# Altium project HotWaterEquipments.PRJPCB
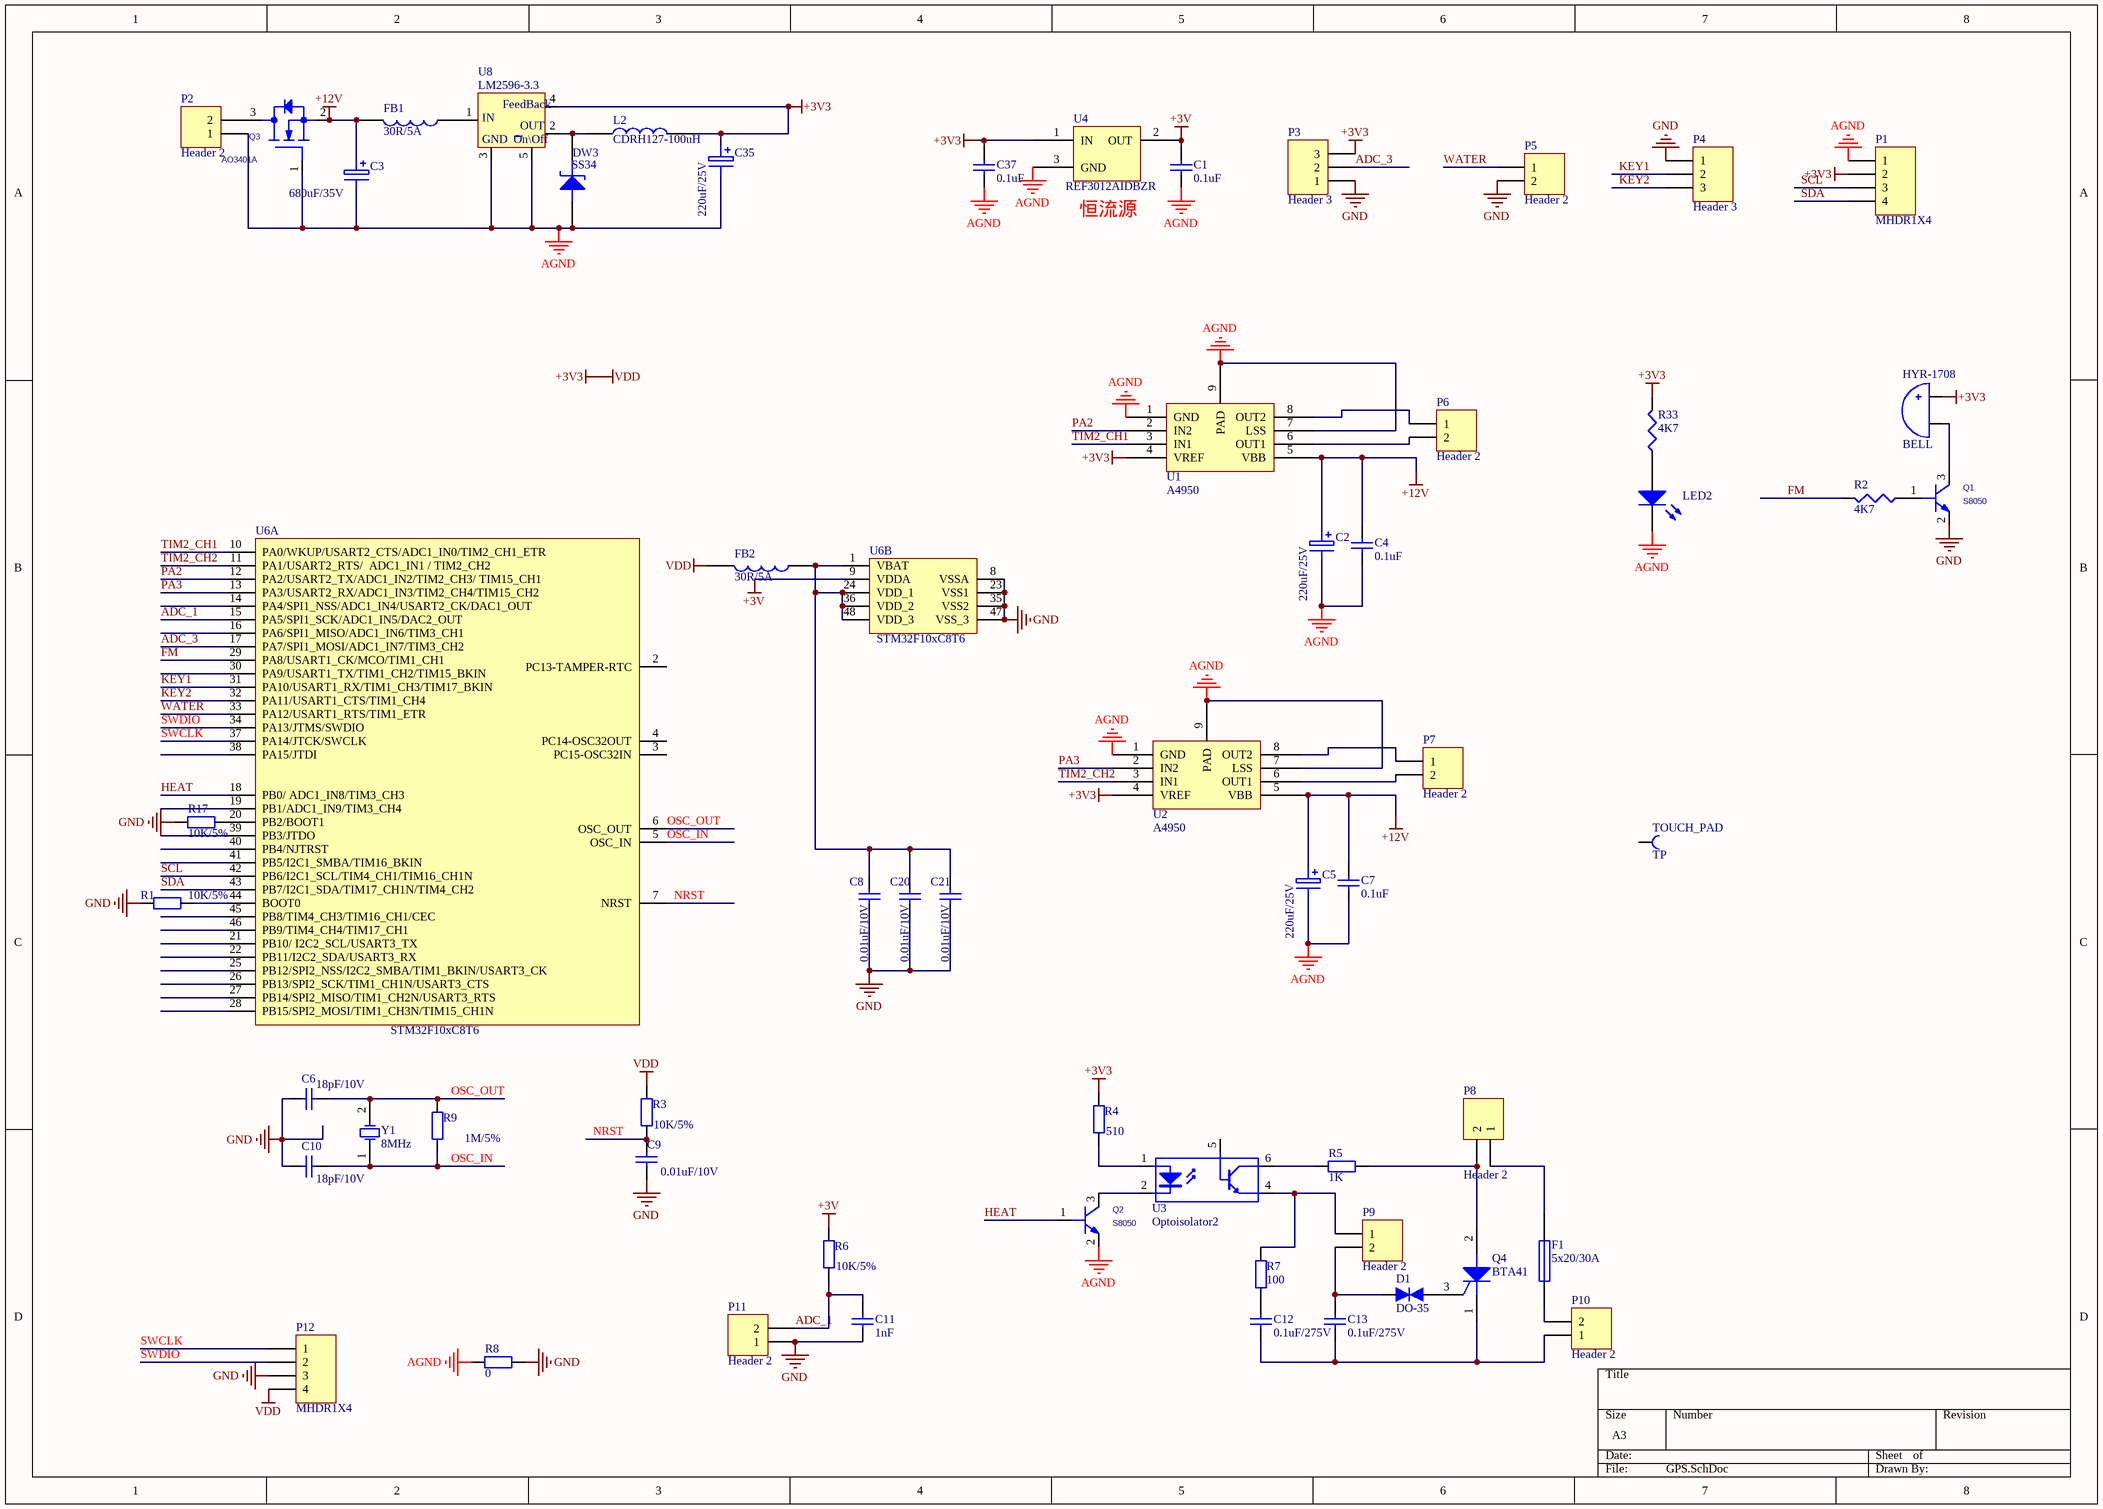
[diagram p0: GPS.SchDoc]
1 sheet, 60 parts. Net scope: global (net labels, ports and power ports of the same name join across sheets).
Board file: 即热式热水器控制系统_主板pcb(V1.9).PcbDoc

## Sheet GPS.SchDoc
size A3

### Parts
C1  0.1uF  [0603C]
C2  220uF/25V  [CAP 2.5*6.3*11.2]
C3  680uF/35V  [CAP 5.0*10*16]
C4  0.1uF  [0603C]
C5  220uF/25V  [CAP 2.5*6.3*11.2]
C6  18pF/10V  [0603C]
C7  0.1uF  [0603C]
C8  0.01uF/10V  [0603C]
C9  0.01uF/10V  [0603c]
C10  18pF/10V  [0603c]
C11  1nF  [0603C]
C12  0.1uF/275V  [CBB 10*12*8]
C13  0.1uF/275V  [CBB 10*12*8]
C20  0.01uF/10V  [0603C]
C21  0.01uF/10V  [0603C]
C35  220uF/25V  [CAP 2.5*6.3*11.2]
C37  0.1uF  [0603C]
D1  DO-35  [DO-35]
DW3  SS34  [SMA]
F1  5x20/30A  [FU BLX-A]
FB1  30R/5A  [L 0805]
FB2  30R/5A  [L 0805]
HYR-1708  BELL  [BEEP 5x9x5.5]
L2  CDRH127-100uH  [CDRH74]
LED2  (no value)  [LED 0805R]
P1  MHDR1X4  [MX 1.25-LS-4P]
P2  Header 2  [VH3.96-LI-2P]
P3  Header 3  [XH2.54-LI-3P]
P4  Header 3  [MX 1.25-LS-3P]
P5  Header 2  [PH2.0-LS-2P]
P6  Header 2  [XH2.54-LI-2P]
P7  Header 2  [XH2.54-LI-2P]
P8  Header 2  [KF2EDGK5.08-LI-2P]
P9  Header 2  [VH3.96-LI-2P]
P10  Header 2  [KF2EDGK5.08-LI-2P]
P11  Header 2  [XH2.54-LI-2P]
P12  MHDR1X4  [MX 1.25-LS-4P]
Q1  S8050  [SOT23-3]
Q2  S8050  [SOT23-3]
Q3  AO3401A  [SOT23-3M]
Q4  BTA41  [TOP-3]
R1  10K/5%  [0603r]
R2  4K7  [0603R]
R3  10K/5%  [0603r]
R4  510  [0603r]
R5  1K  [RS 1W]
R6  10K/5%  [0603r]
R7  100  [RS 1W]
R8  0  [R 0805_M]
R9  1M/5%  [0603R]
R17  10K/5%  [0603r]
R33  4K7  [0603R]
TOUCH_PAD  TP  [SRP12-34-25-P]
U1  A4950  [SOIC_8_EP]
U2  A4950  [SOIC_8_EP]
U3  Optoisolator2  [DIP6-300]
U4  REF3012AIDBZR  [SOT23-3N]
U6  STM32F10xC8T6  [LQFP48 7X7_N]  (parts A,B of 2)
U8  LM2596-3.3  [TO263-5A]
Y1  8MHz  [OSC 5032-2P]

### Nets
+3V: C1.1 R6.2 U4.2(OUT) U6.9(VDDA)
+3V3: C35.1 C37.1 FB2.1 HYR-1708.1(A) L2.1 P1.2 P3.3 P12.4 R3.2 R4.2 R33.2 U1.4(VREF) U2.4(VREF) U4.1(IN) U8.4  [also labelled VDD]
+12V: C2.1 C3.1 C4.1 C5.1 C7.1 FB1.1 Q3.2(SOURCE) U1.5(VBB) U2.5(VBB)
AGND: C1.2 C2.2 C3.2 C4.2 C5.2 C7.2 C35.2 C37.2 DW3.1(A) LED2.2(K) P1.1 P2.1 Q2.2(E) Q3.1(GATE) R8.2 U1.1(GND) U1.7(LSS) U1.9(PAD) U2.1(GND) U2.7(LSS) U2.9(PAD) U4.3(GND) U8.3 U8.5
GND: C6.1 C8.2 C9.1 C10.1 C11.2 C20.2 C21.2 P3.1 P4.1 P5.2 P11.1 P12.3 Q1.2(E) R1.2 R8.1 R17.2 U6.8(VSSA) U6.23(VSS1) U6.35(VSS2) U6.47(VSS_3)
ADC_1: C11.1 P11.2 R6.1 U6.15(PA5/SPI1_SCK/ADC1_IN5/DAC2_OUT)
ADC_3: P3.2 U6.17(PA7/SPI1_MOSI/ADC1_IN7/TIM3_CH2)
FM: R2.2 U6.29(PA8/USART1_CK/MCO/TIM1_CH1)
HEAT: Q2.1(B) U6.18(PB0/_ADC1_IN8/TIM3_CH3)
KEY1: P4.2 U6.31(PA10/USART1_RX/TIM1_CH3/TIM17_BKIN)
KEY2: P4.3 U6.32(PA11/USART1_CTS/TIM1_CH4)
NRST: C9.2 R3.1 U6.7(NRST)
OSC_IN: C10.2 R9.1 U6.5(OSC_IN) Y1.1(OSC1)
OSC_OUT: C6.2 R9.2 U6.6(OSC_OUT) Y1.2(OSC2)
PA2: U1.2(IN2) U6.12(PA2/USART2_TX/ADC1_IN2/TIM2_CH3/_TIM15_CH1)
PA3: U2.2(IN2) U6.13(PA3/USART2_RX/ADC1_IN3/TIM2_CH4/TIM15_CH2)
SCL: P1.3 U6.42(PB6/I2C1_SCL/TIM4_CH1/TIM16_CH1N)
SDA: P1.4 U6.43(PB7/I2C1_SDA/TIM17_CH1N/TIM4_CH2)
SWCLK: P12.1 U6.37(PA14/JTCK/SWCLK)
SWDIO: P12.2 U6.34(PA13/JTMS/SWDIO)
TIM2_CH1: U1.3(IN1) U6.10(PA0/WKUP/USART2_CTS/ADC1_IN0/TIM2_CH1_ETR)
TIM2_CH2: U2.3(IN1) U6.11(PA1/USART2_RTS/__ADC1_IN1_/_TIM2_CH2)
WATER: P5.1 U6.33(PA12/USART1_RTS/TIM1_ETR)
NetC8_1: C8.1 C20.1 C21.1 FB2.2 U6.1(VBAT) U6.24(VDD_1) U6.36(VDD_2) U6.48(VDD_3)
NetC12_1: C12.1 R7.2
NetC12_2: C12.2 C13.2 P10.1 Q4.1(K)
NetC13_1: C13.1 D1.1(A) P9.2
NetD1_2: D1.2(K) Q4.3(G)
NetDW3_2: DW3.2(K) L2.2 U8.2
NetF1_1: F1.1 P10.2
NetF1_2: F1.2 P8.1
NetFB1_2: FB1.2 U8.1
NetHYR-1708_2: HYR-1708.2(B) Q1.3(C)
NetLED2_1: LED2.1(A) R33.1
NetP2_2: P2.2 Q3.3(DRAIN)
NetP6_1: P6.1 U1.8(OUT2)
NetP6_2: P6.2 U1.6(OUT1)
NetP7_1: P7.1 U2.8(OUT2)
NetP7_2: P7.2 U2.6(OUT1)
NetP8_2: P8.2 Q4.2(A) R5.1
NetP9_1: P9.1 R7.1 U3.4(E)
NetQ1_1: Q1.1(B) R2.1
NetQ2_3: Q2.3(C) U3.2(K)
NetR1_1: R1.1 U6.44(BOOT0)
NetR4_1: R4.1 U3.1(A)
NetR5_2: R5.2 U3.6(C)
NetR17_1: R17.1 U6.20(PB2/BOOT1)

Not connected (* = marked no-connect by the designer): TOUCH_PAD 1; U3 5(B); U6 2(PC13-TAMPER-RTC) 3(PC15-OSC32IN) 4(PC14-OSC32OUT) 14(PA4/SPI1_NSS/ADC1_IN4/USART2_CK/DAC1_OUT) 16(PA6/SPI1_MISO/ADC1_IN6/TIM3_CH1) 19(PB1/ADC1_IN9/TIM3_CH4) 21(PB10/_I2C2_SCL/USART3_TX) 22(PB11/I2C2_SDA/USART3_RX) 25(PB12/SPI2_NSS/I2C2_SMBA/TIM1_BKIN/USART3_CK) 26(PB13/SPI2_SCK/TIM1_CH1N/USART3_CTS) 27(PB14/SPI2_MISO/TIM1_CH2N/USART3_RTS) 28(PB15/SPI2_MOSI/TIM1_CH3N/TIM15_CH1N) 30(PA9/USART1_TX/TIM1_CH2/TIM15_BKIN) 38(PA15/JTDI) 39(PB3/JTDO) 40(PB4/NJTRST) 41(PB5/I2C1_SMBA/TIM16_BKIN) 45(PB8/TIM4_CH3/TIM16_CH1/CEC) 46(PB9/TIM4_CH4/TIM17_CH1)

### Notes on the sheet
- (near U4) 恒流源
- (in symbol LM2576) FeedBack; IN; OUT; GND; On\Off

### Library data of the parts
C1 C4 C6 C7 C10 C37 = Cap: Capacitor; Published: 8-Jun-2000; LatestRevisionDate: 17-Jul-2002; LatestRevisionNote: Re-released for DXP Platform.; PackageReference: RAD-0.3; Publisher: Altium Limited
  C1 C4 C7 C37: PackageDescription: Radial Cap, Thru-Hole; 2 Leads; 0.3 in Pin Spacing; Value: 0.1uF
  C6 C10: Value: 18pF/10V
C2 C3 C5 C35 = E01
C8 C20 C21 = Cap: Capacitor; Value: 106; Published: 8-Jun-2000; LatestRevisionDate: 17-Jul-2002; LatestRevisionNote: Re-released for DXP Platform.; PackageReference: RAD-0.3; Publisher: Altium Limited
C9 = Cap: Capacitor; Value: 1uF; Published: 8-Jun-2000; LatestRevisionDate: 17-Jul-2002; LatestRevisionNote: Re-released for DXP Platform.; PackageReference: RAD-0.3; Publisher: Altium Limited
C11-C13 = Cap: Capacitor; Value: 0.1uF; Published: 8-Jun-2000; LatestRevisionDate: 17-Jul-2002; LatestRevisionNote: Re-released for DXP Platform.; PackageReference: RAD-0.3; Publisher: Altium Limited; PackageDescription: Radial Cap, Thru-Hole; 2 Leads; 0.3 in Pin Spacing
D1 = ESD9M5.0S-DTVS105
DW3 = ZENER2: Zener Diode
F1 = Fuse 1: Fuse; Published: 8-Jun-2000; LatestRevisionDate: 17-Jul-2002; LatestRevisionNote: Re-released for DXP Platform.; PackageReference: PIN-W2/E2.8; Publisher: Altium Limited
FB1 FB2 L2 = INDUCTOR1
LED2 = LED0: Typical INFRARED GaAs LED; Published: 8-Jun-2000; LatestRevisionDate: 08-Jul-2005; LatestRevisionNote: Mech Layer 1 removed.; PackageReference: LED-0; Publisher: Altium Limited
P1 P12 = MHDR1X4: Header, 4-Pin; LatestRevisionDate: 17-Jul-2002; LatestRevisionNote: Re-released for DXP Platform.; Publisher: Altium Limited
P2 P5-P11 = Header 2: Header, 2-Pin; LatestRevisionDate: 17-Jul-2002; LatestRevisionNote: Re-released for DXP Platform.; Publisher: Altium Limited
P3 P4 = Header 3: Header, 3-Pin; LatestRevisionDate: 17-Jul-2002; LatestRevisionNote: Re-released for DXP Platform.; Publisher: Altium Limited
Q1 Q2 = 2N1069_1: PspiceTemplate: Q^@REFDES %C %B %E
Q3 = NMOS
Q4 = SCR: Silicon Controlled Rectifier; Published: 8-Jun-2000; LatestRevisionDate: 17-Jul-2002; LatestRevisionNote: Re-released for DXP Platform.; PackageReference: TO-220-AB; Publisher: Altium Limited; Code_JEDEC: TO-220-AB
R1 R8 R9 R17 = Res2: Resistor; Value: 10K; Published: 8-Jun-2000; LatestRevisionDate: 17-Jul-2002; LatestRevisionNote: Re-released for DXP Platform.; PackageReference: AXIAL-0.4; Publisher: Altium Limited
R2 R33 = RES1: P: 1/8W
R3 R6 = Res2: Resistor; Published: 8-Jun-2000; LatestRevisionDate: 17-Jul-2002; LatestRevisionNote: Re-released for DXP Platform.; PackageReference: AXIAL-0.4; Publisher: Altium Limited; Value: 10K/5%
R4 R5 R7 = Res2: Resistor; Value: 10K/5%; Published: 8-Jun-2000; LatestRevisionDate: 17-Jul-2002; LatestRevisionNote: Re-released for DXP Platform.; PackageReference: AXIAL-0.4; Publisher: Altium Limited
TOUCH_PAD = TOUCH_PAD: TEST_3P
U3 = Optoisolator2: 5 Pin Mini Flat Pack Optocoupler; Published: 24-Mar-1999; LatestRevisionDate: 04-Mar-2005; LatestRevisionNote: PCB Footprint replaced, Sch pins re-numbered.; DatasheetVersion: Apr-2004; PackageReference: SOP5(6); Publisher: Altium Limited
U4 = REF3012
U6 = STM32F100C8T6
U8 = LM2576
Y1 = XTAL: Crystal Oscillator; Published: 8-Jun-2000; LatestRevisionDate: 17-Jul-2002; LatestRevisionNote: Re-released for DXP Platform.; PackageReference: R38; Publisher: Altium Limited